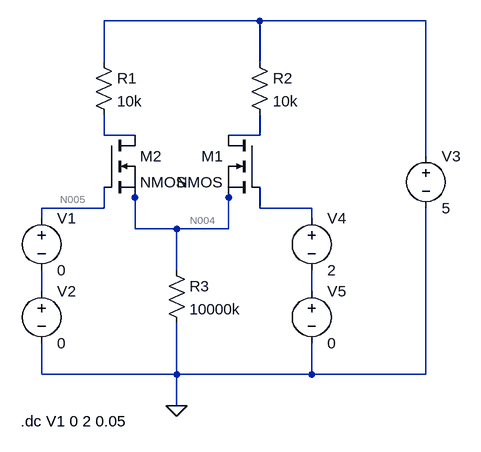
[diagram p0: schematic Draft1.asc]
Draft1.asc, the LTspice schematic file:
Version 4.1
SHEET 1 880 680
WIRE 288 -64 48 -64
WIRE 544 -64 288 -64
WIRE 48 0 48 -64
WIRE 288 0 288 -64
WIRE 48 112 48 80
WIRE 96 112 48 112
WIRE 288 112 288 80
WIRE 288 112 240 112
WIRE 544 144 544 -64
WIRE 96 208 96 192
WIRE 240 208 240 192
WIRE 48 224 48 192
WIRE 48 224 -48 224
WIRE 288 224 288 192
WIRE 368 224 288 224
WIRE -48 240 -48 224
WIRE 368 240 368 224
WIRE 96 256 96 208
WIRE 160 256 96 256
WIRE 240 256 240 208
WIRE 240 256 160 256
WIRE 160 320 160 256
WIRE -48 352 -48 320
WIRE 368 352 368 320
WIRE -48 480 -48 432
WIRE 160 480 160 400
WIRE 160 480 -48 480
WIRE 368 480 368 432
WIRE 368 480 160 480
WIRE 544 480 544 224
WIRE 544 480 368 480
WIRE 160 528 160 480
FLAG 160 528 0
SYMBOL nmos 288 112 M0
SYMATTR InstName M1
SYMBOL nmos 48 112 R0
SYMATTR InstName M2
SYMBOL res 32 -16 R0
SYMATTR InstName R1
SYMATTR Value 10k
SYMBOL res 272 -16 R0
SYMATTR InstName R2
SYMATTR Value 10k
SYMBOL voltage 544 128 R0
SYMATTR InstName V3
SYMATTR Value 5
SYMBOL voltage -48 224 R0
SYMATTR InstName V1
SYMATTR Value 0
SYMBOL voltage -48 336 R0
SYMATTR InstName V2
SYMATTR Value 0
SYMBOL voltage 368 224 R0
WINDOW 123 0 0 Left 0
WINDOW 39 0 0 Left 0
SYMATTR InstName V4
SYMATTR Value 2
SYMBOL voltage 368 336 R0
SYMATTR InstName V5
SYMATTR Value 0
SYMBOL res 144 304 R0
SYMATTR InstName R3
SYMATTR Value 10000k
TEXT -80 552 Left 2 !.dc V1 0 2 0.05

The netlist it stands for:
* Draft1.asc
M1 N003 N006 N004 N004 NMOS
M2 N002 N005 N004 N004 NMOS
R1 N001 N002 10k
R2 N001 N003 10k
V3 N001 0 5
V1 N005 N007 0
V2 N007 0 0
V4 N006 N008 2
V5 N008 0 0
R3 N004 0 10000k
.model NMOS NMOS
.model PMOS PMOS
.lib standard.mos
.dc V1 0 2 0.05
.backanno
.end

* Results of the author's LTspice run, read from the files saved beside the schematic
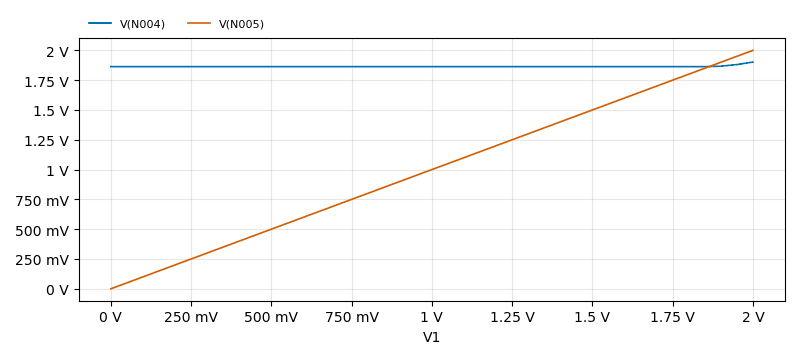
[diagram p1: DC transfer characteristic of Draft1.asc, plotted from the saved traces]
* DC transfer characteristic, 1 run:
*   V(N004): 1.863 V at V1=0 V, 1.902 V at V1=2 V, min 1.863 V, max 1.902 V
*   V(N005): 0 V at V1=0 V, 2 V at V1=2 V, min 0 V, max 2 V